# EAGLE design VB_Dumper (EAGLE 9.0.0)
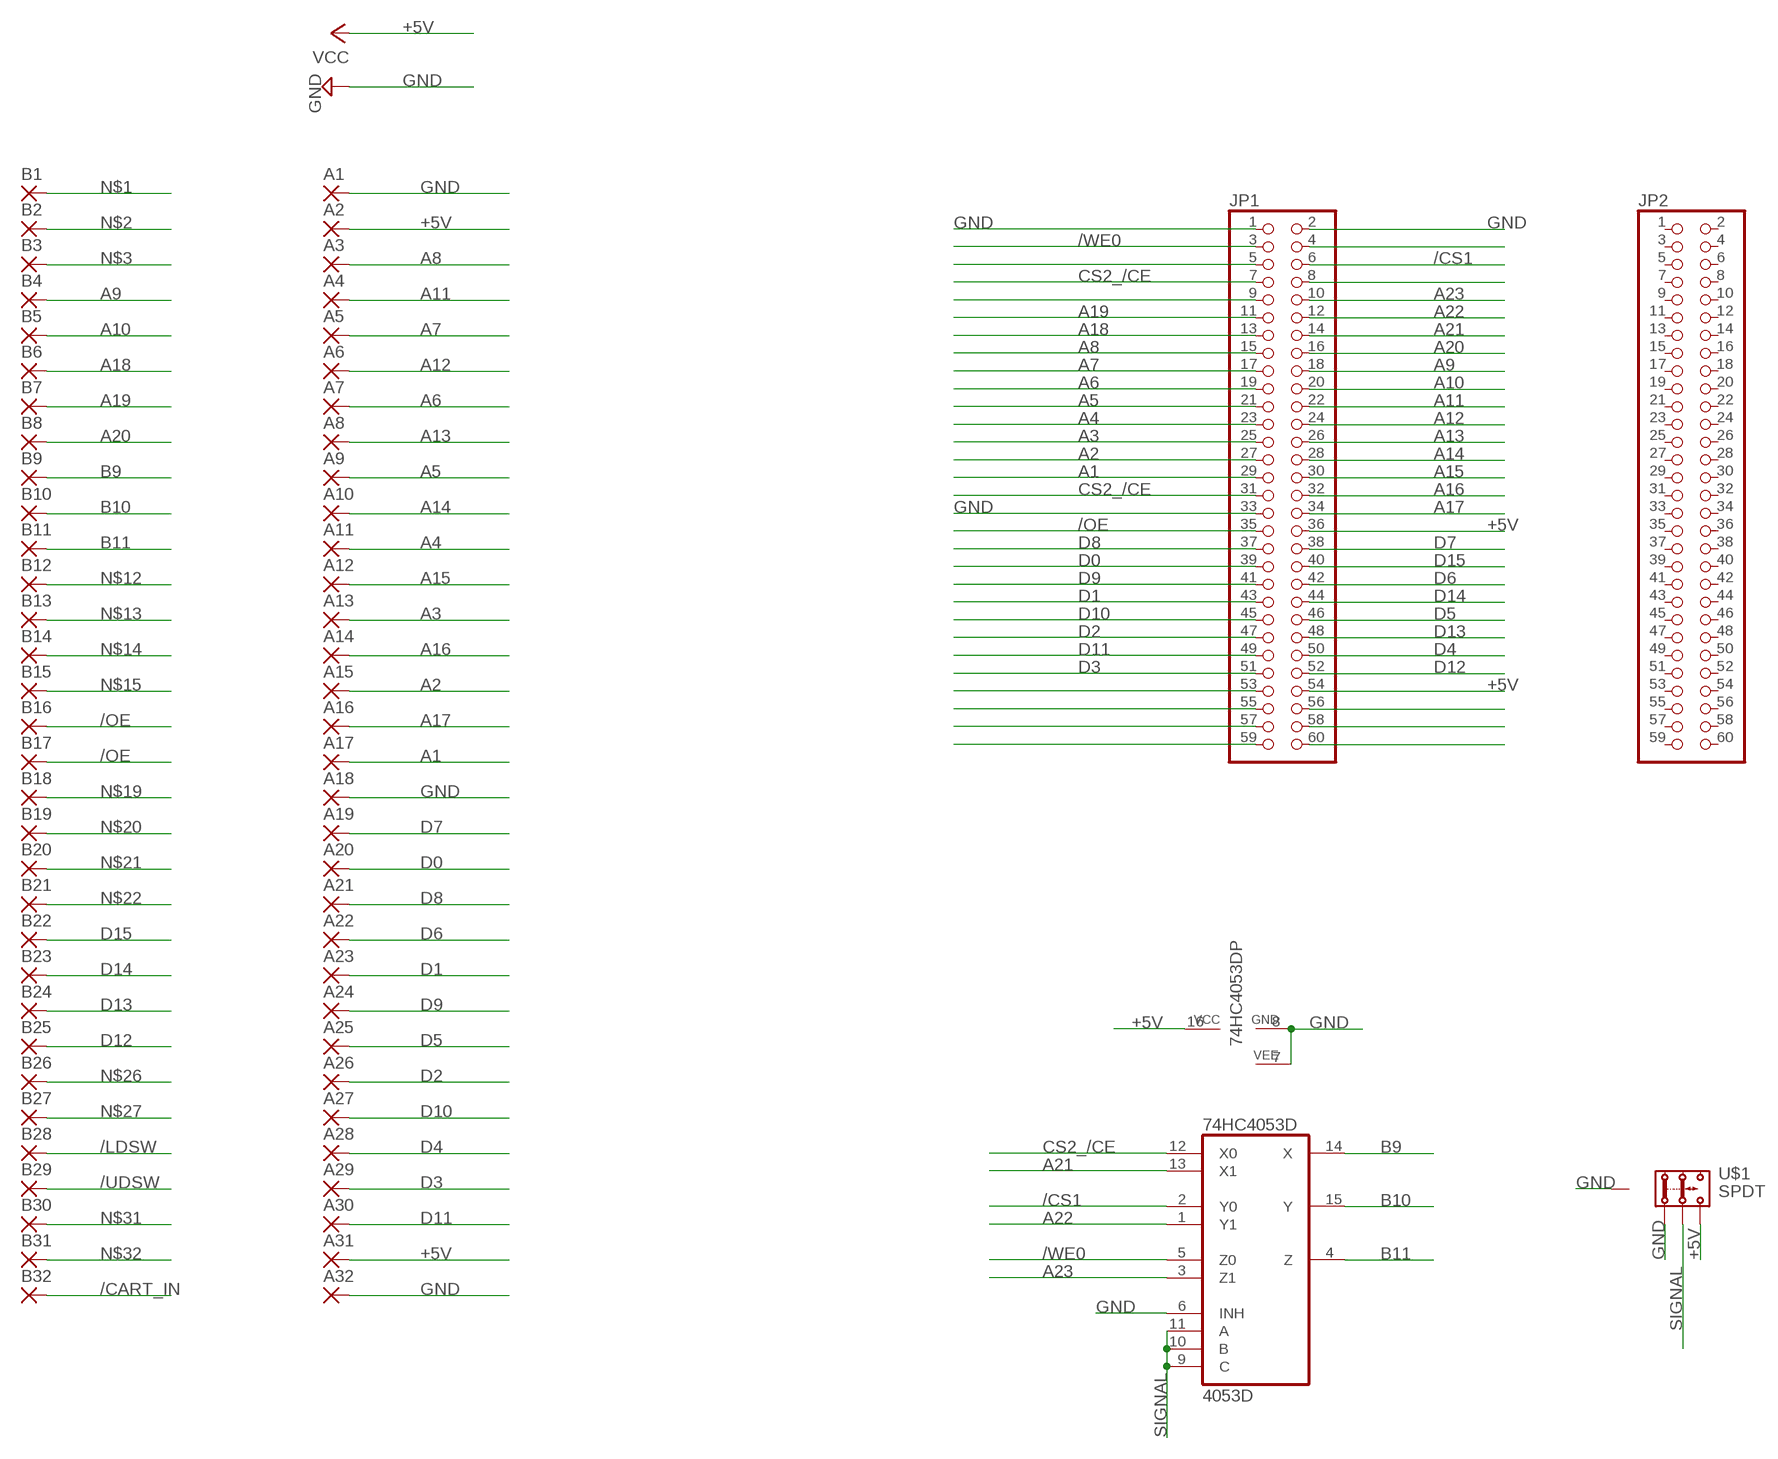
[diagram p0: schematic, sheet 1]

## Parts
74HC4053D  4053D  [SO16]
A1  SMD2  [SMD1,27-2,54]
A2  SMD2  [SMD1,27-2,54]
A3  SMD2  [SMD1,27-2,54]
A4  SMD2  [SMD1,27-2,54]
A5  SMD2  [SMD1,27-2,54]
A6  SMD2  [SMD1,27-2,54]
A7  SMD2  [SMD1,27-2,54]
A8  SMD2  [SMD1,27-2,54]
A9  SMD2  [SMD1,27-2,54]
A10  SMD2  [SMD1,27-2,54]
A11  SMD2  [SMD1,27-2,54]
A12  SMD2  [SMD1,27-2,54]
A13  SMD2  [SMD1,27-2,54]
A14  SMD2  [SMD1,27-2,54]
A15  SMD2  [SMD1,27-2,54]
A16  SMD2  [SMD1,27-2,54]
A17  SMD2  [SMD1,27-2,54]
A18  SMD2  [SMD1,27-2,54]
A19  SMD2  [SMD1,27-2,54]
A20  SMD2  [SMD1,27-2,54]
A21  SMD2  [SMD1,27-2,54]
A22  SMD2  [SMD1,27-2,54]
A23  SMD2  [SMD1,27-2,54]
A24  SMD2  [SMD1,27-2,54]
A25  SMD2  [SMD1,27-2,54]
A26  SMD2  [SMD1,27-2,54]
A27  SMD2  [SMD1,27-2,54]
A28  SMD2  [SMD1,27-2,54]
A29  SMD2  [SMD1,27-2,54]
A30  SMD2  [SMD1,27-2,54]
A31  SMD2  [SMD1,27-2,54]
A32  SMD2  [SMD1,27-2,54]
B1  SMD2  [SMD1,27-2,54]
B2  SMD2  [SMD1,27-2,54]
B3  SMD2  [SMD1,27-2,54]
B4  SMD2  [SMD1,27-2,54]
B5  SMD2  [SMD1,27-2,54]
B6  SMD2  [SMD1,27-2,54]
B7  SMD2  [SMD1,27-2,54]
B8  SMD2  [SMD1,27-2,54]
B9  SMD2  [SMD1,27-2,54]
B10  SMD2  [SMD1,27-2,54]
B11  SMD2  [SMD1,27-2,54]
B12  SMD2  [SMD1,27-2,54]
B13  SMD2  [SMD1,27-2,54]
B14  SMD2  [SMD1,27-2,54]
B15  SMD2  [SMD1,27-2,54]
B16  SMD2  [SMD1,27-2,54]
B17  SMD2  [SMD1,27-2,54]
B18  SMD2  [SMD1,27-2,54]
B19  SMD2  [SMD1,27-2,54]
B20  SMD2  [SMD1,27-2,54]
B21  SMD2  [SMD1,27-2,54]
B22  SMD2  [SMD1,27-2,54]
B23  SMD2  [SMD1,27-2,54]
B24  SMD2  [SMD1,27-2,54]
B25  SMD2  [SMD1,27-2,54]
B26  SMD2  [SMD1,27-2,54]
B27  SMD2  [SMD1,27-2,54]
B28  SMD2  [SMD1,27-2,54]
B29  SMD2  [SMD1,27-2,54]
B30  SMD2  [SMD1,27-2,54]
B31  SMD2  [SMD1,27-2,54]
B32  SMD2  [SMD1,27-2,54]
JP1  PINHD-2X30_2.00  [2X30M]
JP2  PINHD-2X30_2.00  [2X30M]
U$1  SPDT  [SPDT]

## Nets
+5V: 74HC4053D.16(VCC) A2.1(P) A31.1(P) JP1.36 JP1.54 U$1.3.2 ; supply symbol labelled VCC
/CART_IN: B32.1(P)
/CS1: 74HC4053D.2(Y0) JP1.6
/LDSW: B28.1(P)
/OE: B16.1(P) B17.1(P) JP1.35
/UDSW: B29.1(P)
/WE0: 74HC4053D.5(Z0) JP1.3
A1: A17.1(P) JP1.29
A2: A15.1(P) JP1.27
A3: A13.1(P) JP1.25
A4: A11.1(P) JP1.23
A5: A9.1(P) JP1.21
A6: A7.1(P) JP1.19
A7: A5.1(P) JP1.17
A8: A3.1(P) JP1.15
A9: B4.1(P) JP1.18
A10: B5.1(P) JP1.20
A11: A4.1(P) JP1.22
A12: A6.1(P) JP1.24
A13: A8.1(P) JP1.26
A14: A10.1(P) JP1.28
A15: A12.1(P) JP1.30
A16: A14.1(P) JP1.32
A17: A16.1(P) JP1.34
A18: B6.1(P) JP1.13
A19: B7.1(P) JP1.11
A20: B8.1(P) JP1.16
A21: 74HC4053D.13(X1) JP1.14
A22: 74HC4053D.1(Y1) JP1.12
A23: 74HC4053D.3(Z1) JP1.10
B9: 74HC4053D.14(X) B9.1(P)
B10: 74HC4053D.15(Y) B10.1(P)
B11: 74HC4053D.4(Z) B11.1(P)
CS2_/CE: 74HC4053D.12(X0) JP1.7 JP1.31
D0: A20.1(P) JP1.39
D1: A23.1(P) JP1.43
D2: A26.1(P) JP1.47
D3: A29.1(P) JP1.51
D4: A28.1(P) JP1.50
D5: A25.1(P) JP1.46
D6: A22.1(P) JP1.42
D7: A19.1(P) JP1.38
D8: A21.1(P) JP1.37
D9: A24.1(P) JP1.41
D10: A27.1(P) JP1.45
D11: A30.1(P) JP1.49
D12: B25.1(P) JP1.52
D13: B24.1(P) JP1.48
D14: B23.1(P) JP1.44
D15: B22.1(P) JP1.40
GND: 74HC4053D.6(INH) 74HC4053D.7(VEE) 74HC4053D.8(GND) A1.1(P) A18.1(P) A32.1(P) JP1.1 JP1.2 JP1.33 U$1.1.2 U$1.P$1(GND) U$1.P$2(GND)
N$1: B1.1(P)
N$2: B2.1(P)
N$3: B3.1(P)
N$6: JP1.5
N$8: JP1.9
N$12: B12.1(P)
N$13: B13.1(P)
N$14: B14.1(P)
N$15: B15.1(P)
N$19: B18.1(P)
N$20: B19.1(P)
N$21: B20.1(P)
N$22: B21.1(P)
N$26: B26.1(P)
N$27: B27.1(P)
N$31: B30.1(P)
N$32: B31.1(P)
N$43: JP1.53
N$44: JP1.55
N$45: JP1.57
N$46: JP1.59
N$48: JP1.4
N$50: JP1.8
N$74: JP1.56
N$75: JP1.58
N$76: JP1.60
SIGNAL: 74HC4053D.9(C) 74HC4053D.10(B) 74HC4053D.11(A) U$1.2.2
Unconnected: JP2.1 JP2.2 JP2.3 JP2.4 JP2.5 JP2.6 JP2.7 JP2.8 JP2.9 JP2.10 JP2.11 JP2.12 JP2.13 JP2.14 JP2.15 JP2.16 JP2.17 JP2.18 JP2.19 JP2.20 JP2.21 JP2.22 JP2.23 JP2.24 JP2.25 JP2.26 JP2.27 JP2.28 JP2.29 JP2.30 JP2.31 JP2.32 JP2.33 JP2.34 JP2.35 JP2.36 JP2.37 JP2.38 JP2.39 JP2.40 JP2.41 JP2.42 JP2.43 JP2.44 JP2.45 JP2.46 JP2.47 JP2.48 JP2.49 JP2.50 JP2.51 JP2.52 JP2.53 JP2.54 JP2.55 JP2.56 JP2.57 JP2.58 JP2.59 JP2.60

## Library data of the parts
74HC4053D = 40xx:4053: Triple 2-channel ANALOG MULTIPLEXER
A1-A32 B1-B32 = wirepad:SMD2: SMD PAD
JP1 JP2 = pinhead-2:PINHD-2X30: PIN HEADER
U$1 = TRP_Custom:SPDT

## Board
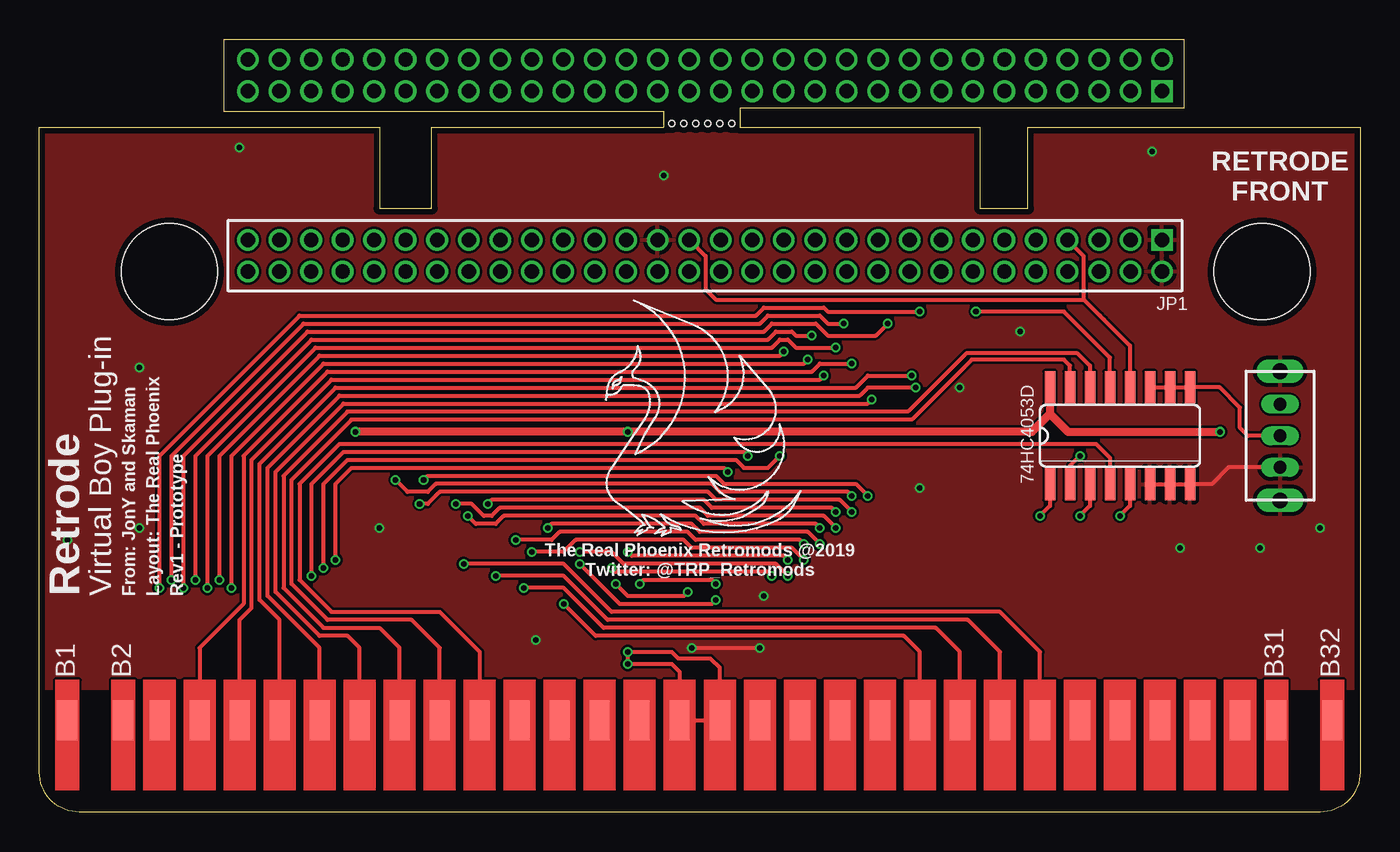
[diagram p1: board, top side]
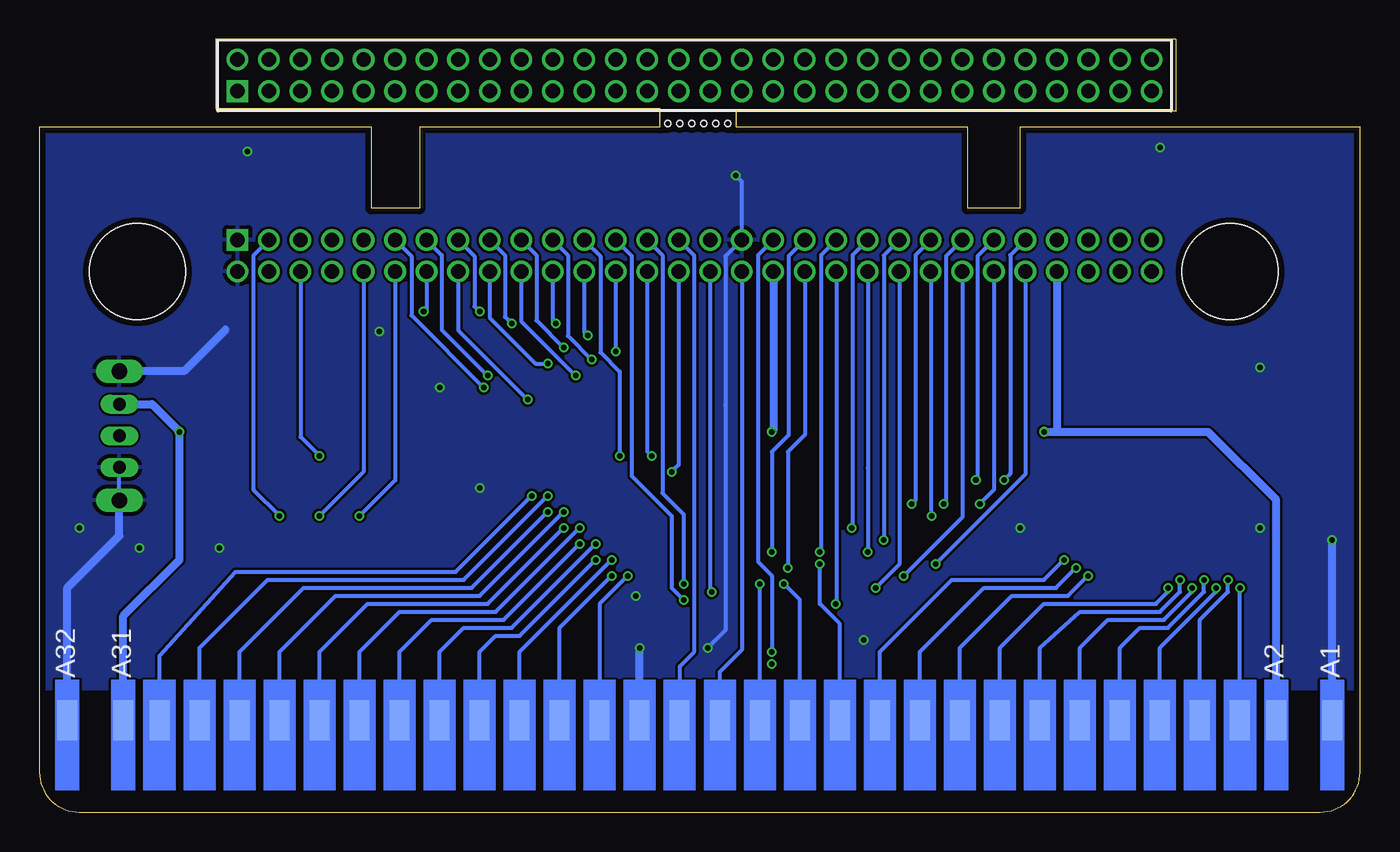
[diagram p2: board, bottom side, seen from below]

Size 83.82 x 49.02 mm. Coordinates in mm from the lower left corner, seen from the top.
Outline: 0,2.54 0,43.43 21.59,43.43 21.59,38.31 24.89,38.31 24.89,43.43 39.62,43.43 39.62,44.45 11.68,44.45 11.68,49.02 72.64,49.02 72.64,44.67 44.45,44.67 44.45,43.43 59.69,43.43 59.69,38.31 62.74,38.31 62.74,43.43 83.82,43.43 83.82,2.54 arc-90 81.28,0 2.54,0 arc-90 0,2.54
Copper layers (1*16): Top 0.035559375mm / dielectric 1.6mm / Bottom 0.035559375mm
Design rules "oshpark-2layer *": minimum track width 6mil, minimum drill 10mil, track to track 6mil, track to pad 6mil, pad to pad 6mil, via to via 6mil, smd to smd 6mil, copper to edge 15mil, drill to drill 6mil, minimum pad ring 5mil, minimum via ring 5mil, stop-mask expansion 2.5mil, vias tented up to drill 15mil, thermal gap 10mil
Holes 6.1 mm at 8.26,34.29 77.6,34.29
Holes 0.4 mm at 41.66,43.69 40.89,43.69 40.13,43.69 43.94,43.69 43.18,43.69 42.42,43.69

### Footprints (pad centres in the part's own frame; a part is rotated, then mirrored left to right if it is on the bottom)
SO16 = smd 0.66 x 2.032: 1 -4.445,-3.073; 2 -3.175,-3.073; 3 -1.905,-3.073; 4 -0.635,-3.073; 5 0.635,-3.073; 6 1.905,-3.073; 7 3.175,-3.073; 8 4.445,-3.073; 9 4.445,3.073; 10 3.175,3.073; 11 1.905,3.073; 12 0.635,3.073; 13 -0.635,3.073; 14 -1.905,3.073; 15 -3.175,3.073; 16 -4.445,3.073
SMD1,27-2,54 = smd 1.27 x 2.54: 1 0,0
2X30M = drill 0.914 square: 1 -24,-1 | drill 0.914: 2 -24,1; 3 -22,-1; 4 -22,1; 5 -20,-1; 6 -20,1; 7 -18,-1; 8 -18,1; 9 -16,-1; 10 -16,1; 11 -14,-1; 12 -14,1; 13 -12,-1; 14 -12,1; 15 -10,-1; 16 -10,1; 17 -8,-1; 18 -8,1; 19 -6,-1; 20 -6,1; 21 -4,-1; 22 -4,1; 23 -2,-1; 24 -2,1; 25 0,-1; 26 0,1; 27 2,-1; 28 2,1; 29 4,-1; 30 4,1; 31 6,-1; 32 6,1; 33 8,-1; 34 8,1; 35 10,-1; 36 10,1; 37 12,-1; 38 12,1; 39 14,-1; 40 14,1; 41 16,-1; 42 16,1; 43 18,-1; 44 18,1; 45 20,-1; 46 20,1; 47 22,-1; 48 22,1; 49 24,-1; 50 24,1; 51 26,-1; 52 26,1; 53 28,-1; 54 28,1; 55 30,-1; 56 30,1; 57 32,-1; 58 32,1; 59 34,-1; 60 34,1
SPDT = drill 0.8 long: 1.2 -2,0; 2.2 0,0; 3.2 2,0 | drill 1 pad 1.422 long: P$1 -4.1,0; P$2 4.1,0

### Placement (x,y rotation side)
74HC4053D  68.58,23.88 0 top
A1  1.78,5.84 0 bottom
A2  5.33,5.84 0 bottom
A3  7.62,5.84 0 bottom
A4  10.16,5.84 0 bottom
A5  12.7,5.84 0 bottom
A6  15.24,5.84 0 bottom
A7  17.78,5.84 0 bottom
A8  20.32,5.84 0 bottom
A9  22.86,5.84 0 bottom
A10  25.4,5.84 0 bottom
A11  27.94,5.84 0 bottom
A12  30.48,5.84 0 bottom
A13  33.02,5.84 0 bottom
A14  35.56,5.84 0 bottom
A15  38.1,5.84 0 bottom
A16  40.64,5.84 0 bottom
A17  43.18,5.84 0 bottom
A18  45.72,5.84 0 bottom
A19  48.26,5.84 0 bottom
A20  50.8,5.84 0 bottom
A21  53.34,5.84 0 bottom
A22  55.88,5.84 0 bottom
A23  58.42,5.84 0 bottom
A24  60.96,5.84 0 bottom
A25  63.5,5.84 0 bottom
A26  66.04,5.84 0 bottom
A27  68.58,5.84 0 bottom
A28  71.12,5.84 0 bottom
A29  73.66,5.84 0 bottom
A30  76.2,5.84 0 bottom
A31  78.49,5.84 0 bottom
A32  82.04,5.84 0 bottom
B1  1.78,5.84 0 top
B2  5.33,5.84 0 top
B3  7.62,5.84 0 top
B4  10.16,5.84 0 top
B5  12.7,5.84 0 top
B6  15.24,5.84 0 top
B7  17.78,5.84 0 top
B8  20.32,5.84 0 top
B9  22.86,5.84 0 top
B10  25.4,5.84 0 top
B11  27.94,5.84 0 top
B12  30.48,5.84 0 top
B13  33.02,5.84 0 top
B14  35.56,5.84 0 top
B15  38.1,5.84 0 top
B16  40.64,5.84 0 top
B17  43.18,5.84 0 top
B18  45.72,5.84 0 top
B19  48.26,5.84 0 top
B20  50.8,5.84 0 top
B21  53.34,5.84 0 top
B22  55.88,5.84 0 top
B23  58.42,5.84 0 top
B24  60.96,5.84 0 top
B25  63.5,5.84 0 top
B26  66.04,5.84 0 top
B27  68.58,5.84 0 top
B28  71.12,5.84 0 top
B29  73.66,5.84 0 top
B30  76.2,5.84 0 top
B31  78.49,5.84 0 top
B32  82.04,5.84 0 top
JP1  47.24,35.31 180 top
JP2  47.24,46.74 0 bottom
U$1  78.74,23.88 90 top
U$2  [LOGO]  32.51,16 0 top

### Tracks (layer width: path | path; a pad name or v marks a point on that pad's centre or on a via)
+5V  (via drill 0.35)
  Top 0.508: 74HC4053D.16 64.14,25.27 | 64.14,25.27 62.99,24.13 v37.34,24.13 v20.07,24.13 | 64.14,25.27 65.28,24.13 v74.93,24.13
  Bottom 0.508: U$1.3.2 76.68,25.88 v74.93,24.13 74.93,16 78.49,12.45 A31.1 | v20.07,24.13 19.3,24.13 | 19.3,24.13 9.65,24.13 5.33,19.81 A2.1 | JP1.54 19.24,24.19 19.3,24.13 | JP1.36 37.24,24.22 v37.34,24.13
/CS1  (via drill 0.35)
  Top 0.254: 74HC4053D.2 65.41,21.97 v66.04,22.61
  Bottom 0.254: JP1.6 67.24,23.81 v66.04,22.61
/OE  (via drill 0.35)
  Top 0.254: B16.1 B17.1 43.18,9.14 42.57,9.76 40.54,9.76 40.13,10.16 v37.34,10.16 v37.34,9.4 40.13,9.4 40.64,8.89 B16.1
  Bottom 0.254: JP1.35 38.21,35.34 38.21,15.89 37.34,14.99 v37.34,10.16
/WE0  (via drill 0.35)
  Top 0.254: 74HC4053D.5 69.22,19.43 v68.58,18.8
  Bottom 0.254: v68.58,18.8 70.21,20.42 70.21,35.34 JP1.3
A1
  Bottom 0.254: A17.1 43.18,9.23 42.28,10.13 42.28,35.34 JP1.29
A2  (via drill 0.35)
  Top 0.254: v38.1,14.48 38.35,14.73 42.67,14.73 v42.93,14.48
  Bottom 0.254: A15.1 v38.1,14.48 | v42.93,14.48 42.93,18.88 44.28,20.23 44.28,35.34 JP1.27
A3  (via drill 0.35)
  Top 0.254: v34.29,15.75 36.83,13.21 42.67,13.21 v42.93,13.46
  Bottom 0.254: A13.1 33.02,11.94 34.29,13.21 v34.29,15.75 | v42.93,13.46 43.69,14.22 43.69,18.8 46.23,21.34 46.23,35.29 JP1.25
A4  (via drill 0.35)
  Top 0.254: v18.03,15.49 18.03,20.83 19.56,22.35 44.2,22.35 44.7,21.84 46.23,21.84 v46.99,22.61
  Bottom 0.254: A11.1 27.94,10.16 23.88,14.22 19.3,14.22 v18.03,15.49 | v46.99,22.61 46.99,27.94 48.21,29.16 48.21,35.26 49.24,36.29 JP1.23
A5  (via drill 0.35)
  Top 0.254: v12.19,14.22 12.19,22.61 18.03,28.45 48.51,28.45 v48.77,28.7
  Bottom 0.254: A9.1 22.86,10.41 20.07,13.21 12.95,13.21 12.19,13.97 v12.19,14.22 | JP1.21 50.28,35.34 50.28,30.21 v48.77,28.7
A6  (via drill 0.35)
  Top 0.254: v10.67,14.22 10.67,22.61 17.53,29.46 46.48,29.46 46.99,29.97 47.5,29.97 48.01,29.46 v50.55,29.46
  Bottom 0.254: A7.1 17.78,10.41 16,12.19 12.45,12.19 10.67,13.97 v10.67,14.22 | JP1.19 52.28,35.34 52.28,31.2 v50.55,29.46
A7  (via drill 0.35)
  Top 0.254: v9.14,14.22 9.14,22.61 17.02,30.48 45.97,30.48 46.48,30.99 49.28,30.99 50.04,30.23 53.09,30.23 v53.85,30.99
  Bottom 0.254: A5.1 12.7,10.41 9.14,13.97 v9.14,14.22 | JP1.17 54.28,35.34 54.28,31.42 v53.85,30.99
A8  (via drill 0.35)
  Top 0.254: v7.62,14.22 7.62,22.61 16.51,31.5 45.47,31.5 45.97,32 49.78,32 50.04,31.75 v55.88,31.75
  Bottom 0.254: A3.1 v7.62,14.22 | JP1.15 56.21,35.27 56.21,32.08 v55.88,31.75
A9  (via drill 0.35)
  Top 0.254: B4.1 10.16,10.41 12.95,13.21 12.95,22.61 18.29,27.94 49.02,27.94 49.53,28.45 v51.56,28.45
  Bottom 0.254: JP1.18 55.24,31.37 52.32,28.45 v51.56,28.45
A10  (via drill 0.35)
  Top 0.254: B5.1 12.7,12.19 13.46,12.95 13.46,22.35 18.54,27.43 49.53,27.43 v49.78,27.69
  Bottom 0.254: JP1.20 53.24,31.15 v49.78,27.69
A11  (via drill 0.35)
  Top 0.254: v8.38,14.73 8.38,22.61 16.76,30.99 45.72,30.99 46.23,31.5 49.53,31.5 50.04,30.99 v51.05,30.99
  Bottom 0.254: A4.1 10.16,12.19 8.38,13.97 v8.38,14.73 | JP1.22 51.24,31.18 v51.05,30.99
A12  (via drill 0.35)
  Top 0.254: v9.91,14.73 9.91,22.61 17.27,29.97 46.23,29.97 46.74,30.48 47.75,30.48 48.01,30.23 v49.02,30.23
  Bottom 0.254: A6.1 15.24,10.41 13.97,11.68 12.19,11.68 9.91,13.97 v9.91,14.73 | JP1.24 49.24,30.45 v49.02,30.23
A13  (via drill 0.35)
  Top 0.254: v11.43,14.73 11.43,22.61 17.78,28.96 46.99,28.96 v47.24,29.21
  Bottom 0.254: A8.1 20.32,10.41 17.78,12.7 12.7,12.7 11.43,13.97 v11.43,14.73 | JP1.26 v47.24,29.21
A14  (via drill 0.35)
  Top 0.254: v17.27,14.99 17.27,20.83 19.3,22.86 44.7,22.86 v44.96,22.61
  Bottom 0.254: A10.1 25.4,10.41 22.1,13.72 18.54,13.72 v17.27,14.99 | v44.96,22.61 45.24,22.89 JP1.28
A15  (via drill 0.35)
  Top 0.254: v18.8,16 18.8,20.83 19.81,21.84 43.43,21.84 v43.69,21.59
  Bottom 0.254: A12.1 30.48,10.16 25.91,14.73 20.07,14.73 v18.8,16 | JP1.30 43.24,22.03 v43.69,21.59
A16  (via drill 0.35)
  Top 0.254: v36.58,14.48 37.34,13.72 40.89,13.72 v41.15,13.97
  Bottom 0.254: A14.1 35.56,13.46 v36.58,14.48 | v41.15,13.97 41.24,14.07 JP1.32
A17
  Bottom 0.254: A16.1 40.64,8.89 39.5,10.03 39.37,10.16 39.24,10.29 JP1.34
A18  (via drill 0.35)
  Top 0.254: B6.1 15.24,12.19 13.97,13.46 13.97,22.1 18.8,26.92 51.82,26.92 52.58,27.69 v55.37,27.69
  Bottom 0.254: JP1.13 58.28,35.34 58.28,30.59 v55.37,27.69
A19  (via drill 0.35)
  Top 0.254: B7.1 17.78,10.41 14.48,13.72 14.48,21.84 19.05,26.42 52.07,26.42 52.58,26.92 v55.63,26.92
  Bottom 0.254: JP1.11 60.21,35.27 60.21,31.51 v55.63,26.92
A20  (via drill 0.35)
  Top 0.254: B8.1 20.32,10.41 19.56,11.18 17.78,11.18 14.99,13.97 14.99,21.59 19.3,25.91 52.58,25.91 v52.83,26.16
  Bottom 0.254: v52.83,26.16 57.24,30.57 JP1.16
A21  (via drill 0.35)
  Top 0.254: 74HC4053D.13 67.94,28.83 65.02,31.75 v59.44,31.75
  Bottom 0.254: JP1.14 59.24,31.94 v59.44,31.75
A22  (via drill 0.35)
  Top 0.254: 74HC4053D.1 64.14,19.43 v63.5,18.8
  Bottom 0.254: JP1.12 61.24,21.05 v63.5,18.8
A23  (via drill 0.35)
  Top 0.254: 74HC4053D.3 66.67,19.43 v66.04,18.8
  Bottom 0.254: JP1.10 63.24,21.59 v66.04,18.8
B9
  Top 0.254: 74HC4053D.14 66.67,28.32 65.89,29.11 58.83,29.11 55.12,25.4 19.56,25.4 15.49,21.34 15.49,14.22 18.03,11.68 21.59,11.68 22.86,10.41 B9.1
B10
  Top 0.254: 74HC4053D.15 65.41,28.32 65.02,28.7 59.18,28.7 55.37,24.89 19.81,24.89 16,21.08 16,14.48 18.29,12.19 23.62,12.19 25.4,10.41 B10.1
B11
  Top 0.254: B11.1 27.94,10.16 25.4,12.7 18.54,12.7 16.51,14.73 16.51,20.83 19.05,23.37 67.06,23.37 67.94,22.48 74HC4053D.4
CS2_/CE
  Top 0.254: JP1.31 42.28,35.27 42.28,33.16 42.93,32.51 66.29,32.51 | 66.29,32.51 67.31,31.5 67.56,31.24 69.22,29.59 74HC4053D.12 | 66.29,32.51 66.28,32.53 66.28,35.27 JP1.7
D0  (via drill 0.35)
  Top 0.254: v47.5,14.99 46.74,15.75 37.08,15.75 36.32,16.51 v34.29,16.51
  Bottom 0.254: A20.1 50.8,11.68 v47.5,14.99 | JP1.39 34.21,35.34 34.21,16.59 v34.29,16.51
D1  (via drill 0.35)
  Top 0.254: v48.51,17.02 48.26,17.27 41.66,17.27 41.15,17.78 33.02,17.78 32.51,17.27 v30.23,17.27
  Bottom 0.254: v48.51,17.02 53.85,11.68 56.9,11.68 58.42,10.16 A23.1 | JP1.43 30.23,35.32 v30.23,17.27
D2  (via drill 0.35)
  Top 0.254: v50.55,18.03 49.78,18.8 42.42,18.8 41.91,19.3 29.21,19.3 28.7,18.8 28.19,18.8 27.43,19.56 v26.42,19.56
  Bottom 0.254: A26.1 66.04,10.16 62.99,13.21 55.37,13.21 v50.55,18.03 | JP1.47 26.28,35.27 26.28,19.7 v26.42,19.56
D3  (via drill 0.35)
  Top 0.254: v51.56,20.07 51.31,20.32 43.18,20.32 42.67,20.83 25.15,20.83 24.64,20.32 23.37,20.32 v22.61,21.08
  Bottom 0.254: A29.1 73.66,10.41 69.34,14.73 56.9,14.73 v51.56,20.07 | JP1.51 22.21,35.34 22.21,21.48 v22.61,21.08
D4  (via drill 0.35)
  Top 0.254: v51.56,19.05 50.8,19.81 42.93,19.81 42.42,20.32 25.4,20.32 24.64,19.56 v24.13,19.56
  Bottom 0.254: v51.56,19.05 56.39,14.22 67.06,14.22 71.12,10.16 A28.1 | v24.13,19.56 23.24,20.44 JP1.50
D5  (via drill 0.35)
  Top 0.254: v49.53,18.03 49.28,18.29 42.16,18.29 41.66,18.8 29.46,18.8 28.96,18.29 27.69,18.29 v27.18,18.8
  Bottom 0.254: A25.1 63.5,10.16 60.96,12.7 54.86,12.7 v49.53,18.03 | JP1.46 27.24,18.98 v27.18,18.8
D6  (via drill 0.35)
  Top 0.254: v48.51,16 47.75,16.76 41.4,16.76 40.89,17.27 34.04,17.27 33.27,16.51 v31.24,16.51
  Bottom 0.254: A22.1 55.88,10.16 54.86,11.18 53.34,11.18 v48.51,16 | JP1.42 31.24,21.84 v31.24,16.51
D7  (via drill 0.35)
  Top 0.254: v46.48,14.99 46.23,15.24 36.58,15.24 v36.32,15.49
  Bottom 0.254: v46.48,14.99 48.26,13.21 A19.1 | JP1.38 35.24,23.94 36.32,22.86 v36.32,15.49
D8  (via drill 0.35)
  Top 0.254: v47.5,16 47.24,16.26 37.59,16.26 v37.34,16.51
  Bottom 0.254: A21.1 53.34,10.16 v47.5,16 | JP1.37 36.28,35.27 36.28,23.92 37.34,22.86 v37.34,16.51
D9  (via drill 0.35)
  Top 0.254: v49.53,17.02 48.77,17.78 41.91,17.78 41.4,18.29 32.51,18.29 v32.26,18.03
  Bottom 0.254: A24.1 60.96,10.16 58.93,12.19 54.36,12.19 v49.53,17.02 | JP1.41 32.21,35.34 32.21,22.61 32.21,22.15 32.21,18.08 v32.26,18.03
D10  (via drill 0.35)
  Top 0.254: v50.55,19.05 50.29,19.3 42.67,19.3 42.16,19.81 28.7,19.81 v28.45,19.56
  Bottom 0.254: A27.1 68.58,10.16 65.02,13.72 55.88,13.72 v50.55,19.05 | JP1.45 28.21,35.34 28.21,19.8 v28.45,19.56
D11  (via drill 0.35)
  Top 0.254: v24.38,21.08 24.64,21.34 42.93,21.34 43.43,20.83 51.82,20.83 v52.58,20.07
  Bottom 0.254: A30.1 76.2,9.91 71.37,15.24 57.4,15.24 v52.58,20.07 | JP1.49 24.28,35.27 24.28,21.19 v24.38,21.08
D12  (via drill 0.35)
  Top 0.254: B25.1 63.5,10.16 60.96,12.7 36.32,12.7 33.27,15.75 v26.92,15.75
  Bottom 0.254: JP1.52 21.24,21.43 v26.92,15.75
D13  (via drill 0.35)
  Top 0.254: B24.1 60.96,10.16 58.93,12.19 36.07,12.19 33.27,14.99 v28.96,14.99
  Bottom 0.254: JP1.48 25.24,18.7 v28.96,14.99
D14  (via drill 0.35)
  Top 0.254: B23.1 58.42,10.16 56.9,11.69 35.81,11.68 33.27,14.22 v30.73,14.22
  Bottom 0.254: JP1.44 29.24,15.71 v30.73,14.22
D15  (via drill 0.35)
  Top 0.254: B22.1 55.88,10.16 54.86,11.18 35.31,11.18 v33.27,13.21
  Bottom 0.254: JP1.40 33.24,13.24 v33.27,13.21
GND  (via drill 0.35)
  Top 0.254: 74HC4053D.6 74HC4053D.7 74HC4053D.8 74.4,20.8 75.47,21.88 U$1.1.2 | v41.4,10.41 v45.72,10.41
  Bottom 0.254: U$1.P$1 78.74,20.07 U$1.1.2 | 40.9,10.92 v41.4,10.41 40.28,11.53 40.28,25.82 40.28,25.83 40.28,35.27 JP1.33 39.24,40.01 v39.62,40.39
  Bottom 0.508: A18.1 v45.72,10.41 | 78.74,20.07 78.74,17.53 82.04,14.22 A32.1 | A1.1 v1.78,17.27 | U$1.P$2 74.64,27.98 72.01,30.61
  other vias: 31.5,10.92 21.59,18.03 12.7,42.16 6.35,28.19 6.35,18.03 55.88,20.57 72.39,16.76 77.47,16.76 81.28,18.03 58.42,26.92 70.61,41.91 62.23,30.48 45.97,13.72
  pour Bottom: -3.3,53.85 86.61,53.85 86.61,7.85 -3.3,7.85
  pour Top: -5.59,51.82 88.14,51.82 88.14,7.85 -5.59,7.85
SIGNAL
  Top 0.254: 74HC4053D.11 74HC4053D.10 74HC4053D.9 74.91,26.95 76.2,25.65 76.2,24.38 76.71,23.88 U$1.2.2
(copper drawn outside any net)
  shapes: Bottom area x32, Top area x32

### Text on the board
tNames: RETRODE / FRONT | The Real Phoenix Retromods @2019 / Twitter: @TRP_Retromods | Retrode | Virtual Boy Plug-in | From: JonY and Skaman | Layout: The Real Phoenix | Rev1 - Prototype